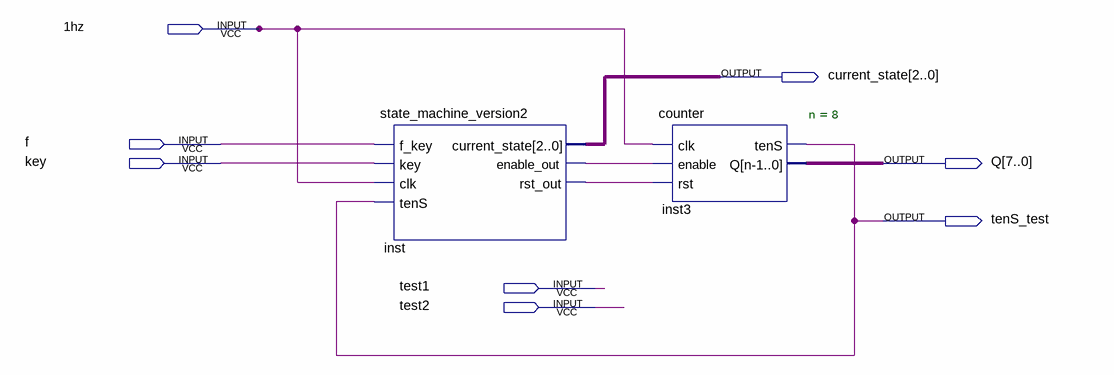
[diagram p0: schematic sheet]
// Quartus schematic fsm.bdf as structural Verilog: 2 symbols, 8 pins
module fsm (
  input  \1hz ,
  input  f,
  input  key,
  input  test1,
  input  test2,
  output [2:0] current_state,
  output [7:0] Q,
  output tenS_test
);

  wire inst_enable_out, inst_rst_out;

  state_machine_version2 inst (
    .f_key(f), .key(key), .clk(\1hz ), .tenS(tenS_test), .current_state(current_state),
    .enable_out(inst_enable_out), .rst_out(inst_rst_out));
  counter #(.n(8)) inst3 (.clk(\1hz ), .enable(inst_enable_out), .rst(inst_rst_out), .tenS(tenS_test), .Q(Q));
endmodule
